# EAGLE design VCO-Simple-Middle (EAGLE 9.1.0)
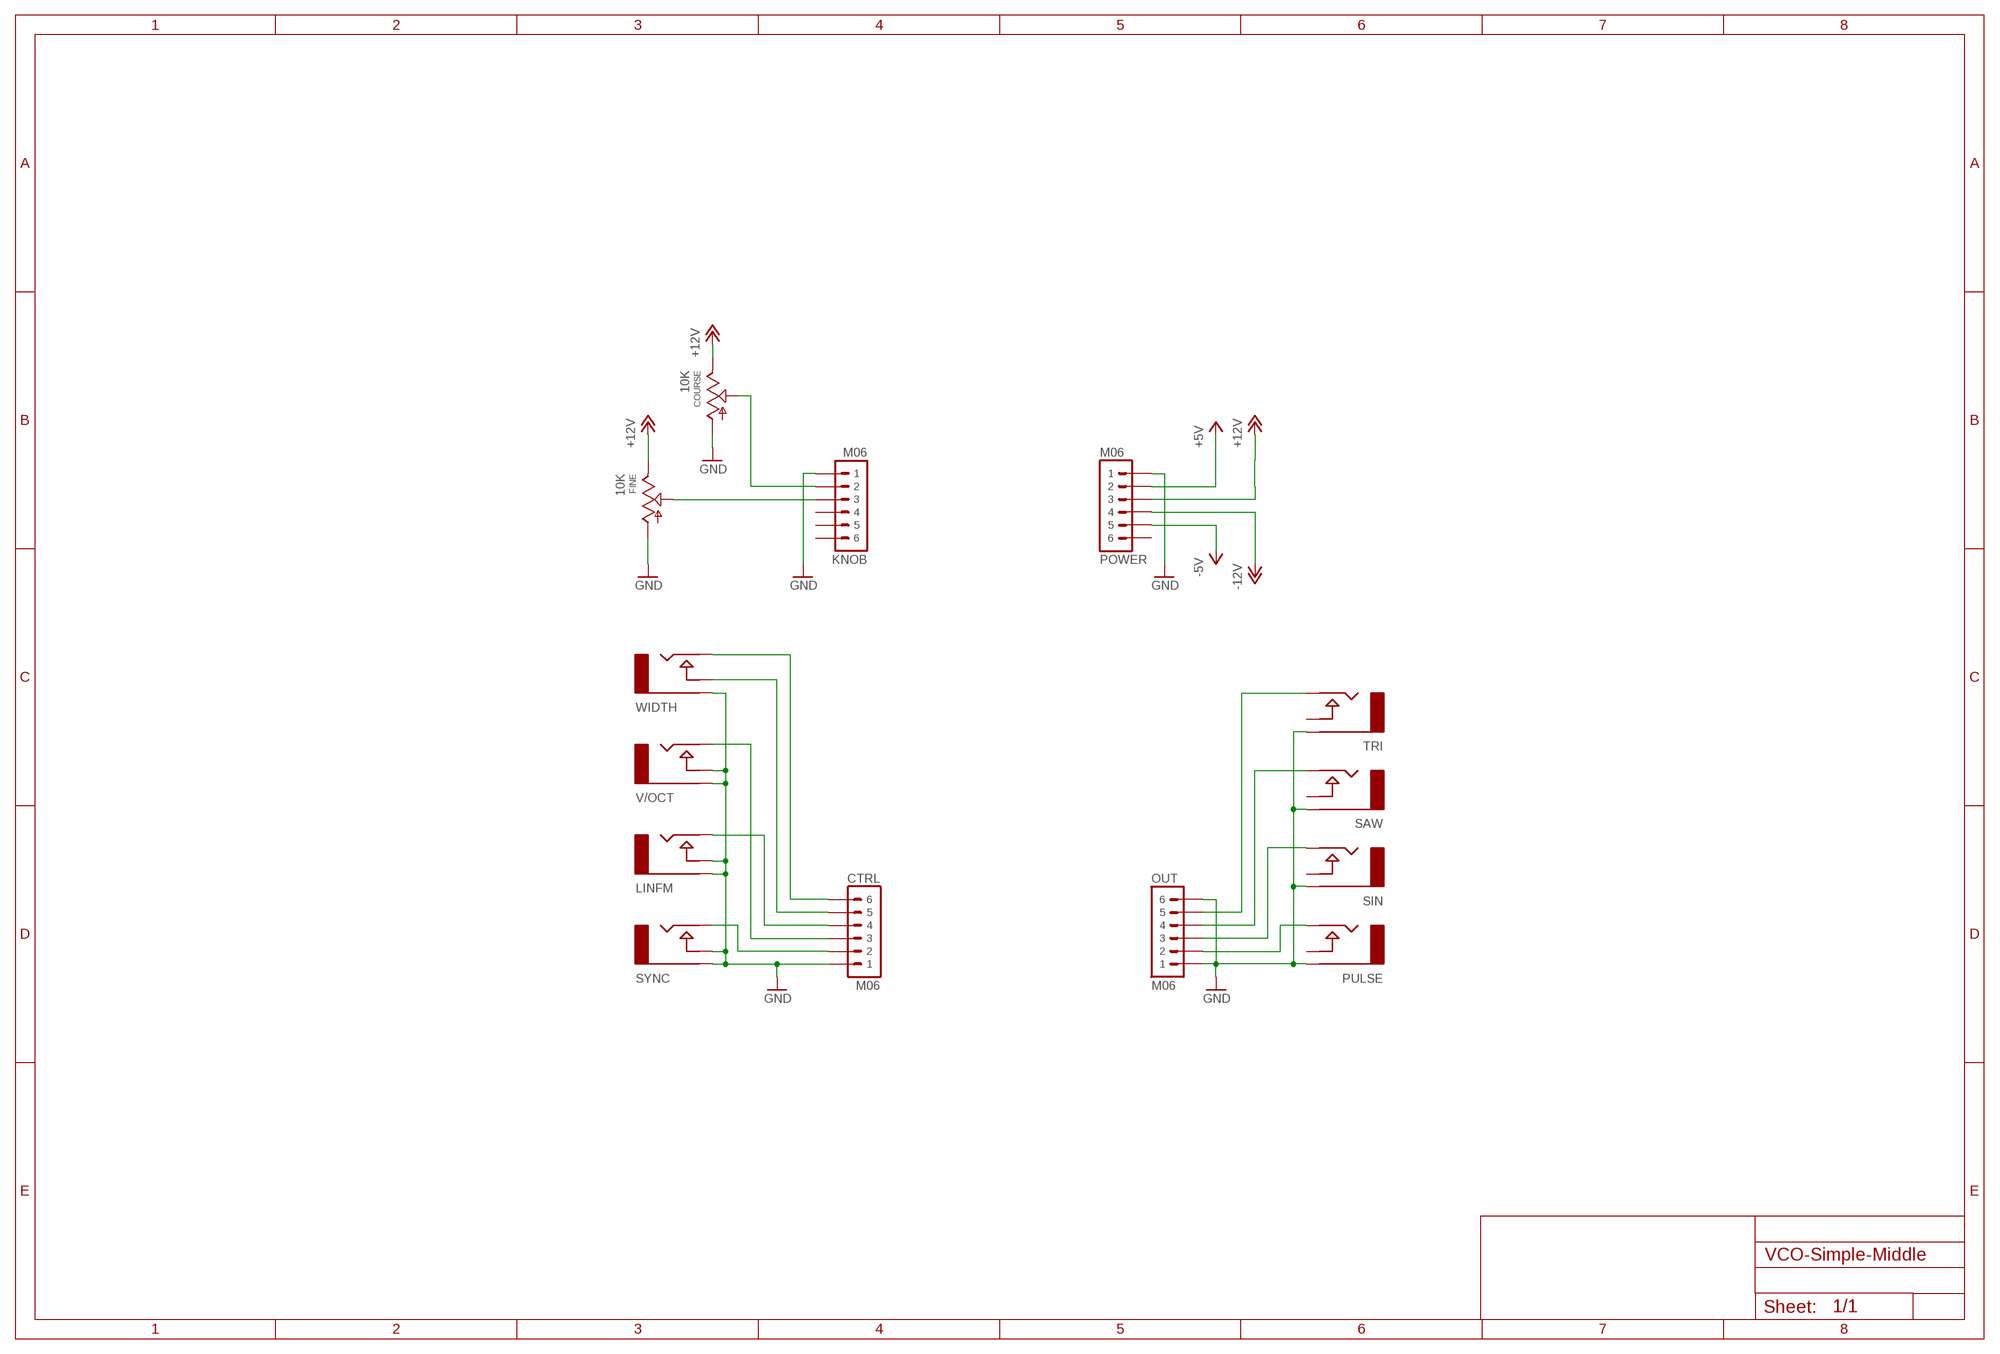
[diagram p0: schematic, sheet 1]

## Parts
COURSE  10K  POTALPHA-9MM  [POT-ALPHA-9MM]
CTRL  M06  [M06]
FINE  10K  POTALPHA-9MM  [POT-ALPHA-9MM]
KNOB  M06  [M06]
LINFM  AUDIO-JACKINLINE  [ERTHENVAR-JACK-INLINE]
OUT  M06  [M06]
POWER  M06  [M06]
PULSE  AUDIO-JACKINLINE  [ERTHENVAR-JACK-INLINE]
SAW  AUDIO-JACKINLINE  [ERTHENVAR-JACK-INLINE]
SIN  AUDIO-JACKINLINE  [ERTHENVAR-JACK-INLINE]
SYNC  AUDIO-JACKINLINE  [ERTHENVAR-JACK-INLINE]
TRI  AUDIO-JACKINLINE  [ERTHENVAR-JACK-INLINE]
V/OCT  AUDIO-JACKINLINE  [ERTHENVAR-JACK-INLINE]
WIDTH  AUDIO-JACKINLINE  [ERTHENVAR-JACK-INLINE]

## Nets
+5V: POWER.2
+12V: COURSE.B(E) FINE.B(E) POWER.3
-5V: POWER.5
-12V: POWER.4
COURSE: COURSE.W(S) KNOB.2
FINE: FINE.W(S) KNOB.3
GND: COURSE.A CTRL.1 FINE.A KNOB.1 LINFM.G(RING) LINFM.N(NORM) OUT.1 OUT.6 POWER.1 PULSE.G(RING) SAW.G(RING) SIN.G(RING) SYNC.G(RING) SYNC.N(NORM) TRI.G(RING) V/OCT.G(RING) V/OCT.N(NORM) WIDTH.G(RING)
LIN: CTRL.4 LINFM.T(TIP)
PULSE: OUT.2 PULSE.T(TIP)
SAW: OUT.4 SAW.T(TIP)
SIN: OUT.3 SIN.T(TIP)
SYNC: CTRL.2 SYNC.T(TIP)
TRI: OUT.5 TRI.T(TIP)
V/OCT: CTRL.3 V/OCT.T(TIP)
WIDTH: CTRL.6 WIDTH.T(TIP)
WIDTH-NORM: CTRL.5 WIDTH.N(NORM)
Unconnected: KNOB.4 KNOB.5 KNOB.6 POWER.6 PULSE.N(NORM) SAW.N(NORM) SIN.N(NORM) TRI.N(NORM)

## Library data of the parts
COURSE FINE = barsstronics:POT
CTRL KNOB OUT POWER = barsstronics:M06
LINFM PULSE SAW SIN SYNC TRI V/OCT WIDTH = erthenvar:AUDIO-JACK: Switching Mono 3.5mm Audio Jack from Erthenvar. Horizontal package.

## Board
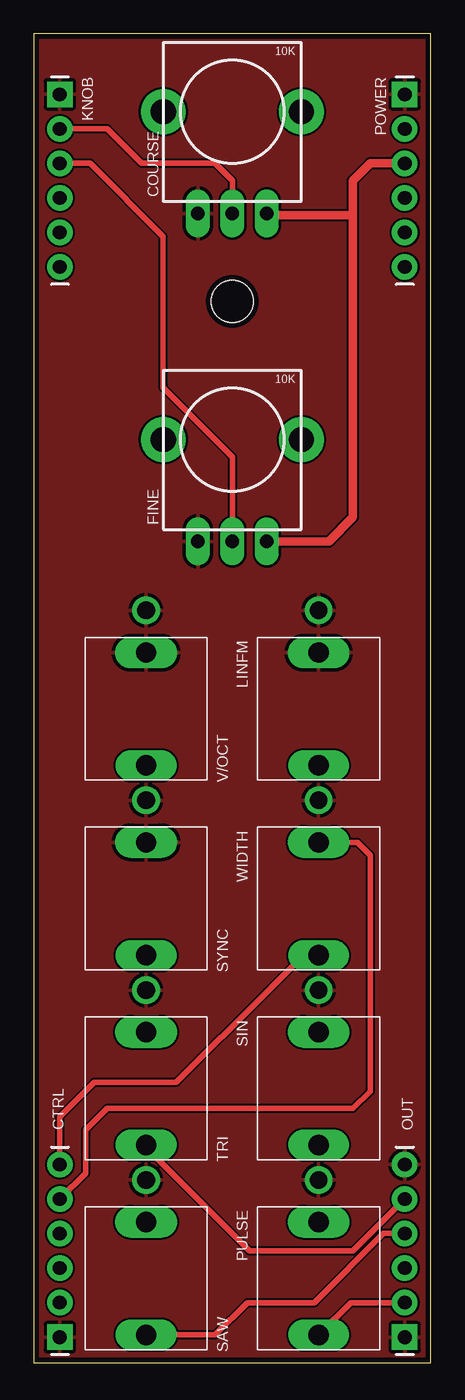
[diagram p1: board, top side]
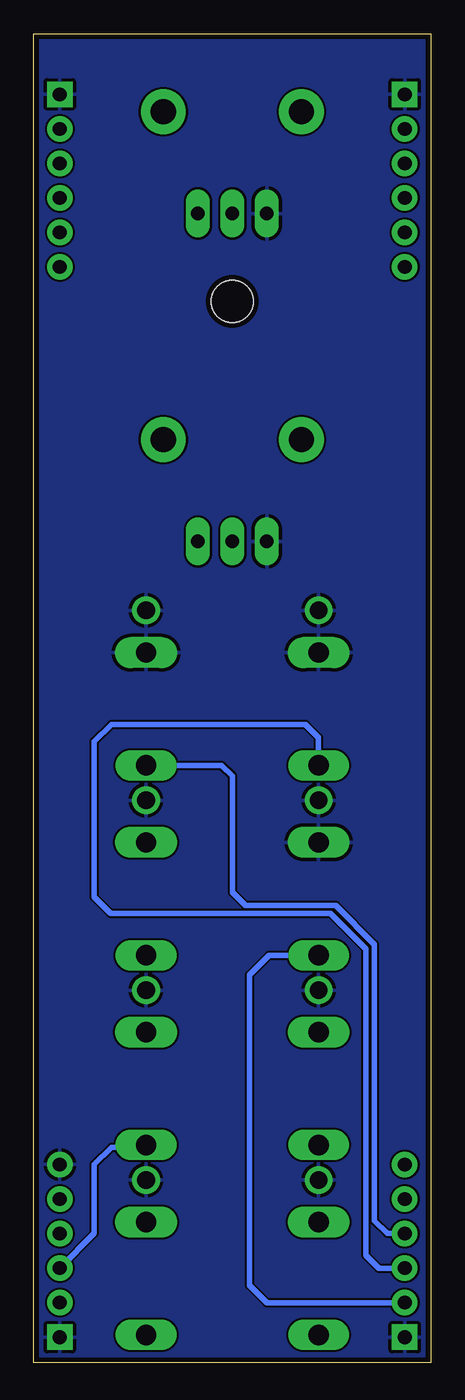
[diagram p2: board, bottom side, seen from below]

Size 29.21 x 97.79 mm. Coordinates in mm from the lower left corner, seen from the top.
Outline: 0,0 29.21,0 29.21,97.79 0,97.79 0,0
Copper layers (1*16): Top 0.035559375mm / dielectric 1.6mm / Bottom 0.035559375mm
Design rules "oshpark-2layer": minimum track width 6mil, minimum drill 10mil, track to track 6mil, track to pad 6mil, pad to pad 6mil, via to via 6mil, smd to smd 6mil, copper to edge 15mil, drill to drill 6mil, minimum pad ring 5mil, minimum via ring 5mil, stop-mask expansion 2.5mil, vias tented up to drill 0mil, thermal gap 10mil
Holes 3.1 mm at 14.61,78.1
tKeepout: area 12.1,75.6 to 17.1,80.6
bKeepout: area 12.1,75.6 to 17.1,80.6

### Footprints (pad centres in the part's own frame; a part is rotated, then mirrored left to right if it is on the bottom)
POT-ALPHA-9MM = drill 1 pad 1.778 long: A -2.54,-7.493; B 2.54,-7.493; W 0,-7.493 | drill 1.85 pad 3.302: MNT1 -5.08,0; MNT2 5.08,0
M06 = drill 1.016 pad 1.88 square: 1 0,0 | drill 1.016 pad 1.88: 2 2.54,0; 3 5.08,0; 4 7.62,0; 5 10.16,0; 6 12.7,0
ERTHENVAR-JACK-INLINE = drill 1.3 pad 2.032: G 0,-6.48 | drill 1.5 pad 2.286 long: N 0,-3.38 | drill 1.5 pad 2.235 long: T 0,4.92

### Placement (x,y rotation side)
COURSE  14.61,92.07 0 top
CTRL  1.91,1.91 90 top
FINE  14.61,67.94 0 top
KNOB  1.91,93.34 270 top
LINFM  20.95,48.9 180 top
OUT  27.3,1.91 90 top
POWER  27.3,93.34 270 top
PULSE  20.95,6.99 180 top
SAW  8.26,6.99 180 top
SIN  20.95,20.95 180 top
SYNC  8.26,34.93 180 top
TRI  8.26,20.95 180 top
V/OCT  8.26,48.9 180 top
WIDTH  20.95,34.93 180 top

### Tracks (layer width: path | path; a pad name or v marks a point on that pad's centre or on a via)
+12V
  Top 0.61: COURSE.B 17.27,84.45 22.22,84.45 23.49,84.45 | 23.49,84.45 23.49,62.23 21.72,60.45 FINE.B | 23.49,84.45 23.49,86.99 24.76,88.27 POWER.3
COURSE
  Top 0.406: COURSE.W 14.61,86.99 13.34,88.27 7.94,88.27 5.4,90.8 KNOB.2
FINE
  Top 0.406: FINE.W 14.61,66.67 9.53,71.75 9.53,82.87 4.13,88.27 KNOB.3
GND
  pour Top: 29.21,97.79 29.21,0 0,0 0,97.79 1.27,97.79
  pour Bottom: 29.21,97.79 29.21,0 0,0 0,97.79
LIN
  Bottom 0.406: CTRL.4 3.17,9.53 4.13,10.48 4.13,30.8 6.99,33.66 13.65,33.66 14.61,34.61 14.61,43.18 15.4,43.98 LINFM.T
PULSE
  Top 0.406: PULSE.T 23.33,4.45 OUT.2
SAW
  Top 0.406: SAW.T 13.34,2.07 15.72,4.45 20.64,4.45 25.72,9.53 OUT.4
SIN
  Bottom 0.406: SIN.T 21.11,15.88 21.03,15.8 21.11,15.88 23.49,15.88 24.76,14.61 24.76,9.53 OUT.3
SYNC
  Bottom 0.406: CTRL.2 12.06,4.45 13.34,5.71 13.34,28.57 11.9,30 SYNC.T
TRI
  Top 0.406: OUT.5 23.49,8.26 15.88,8.26 8.26,15.88 TRI.T
V/OCT
  Bottom 0.406: V/OCT.T 8.26,46.04 9.21,46.99 23.49,46.99 24.76,45.72 24.76,34.29 23.57,33.1 7.38,33.1 4.76,30.48 4.76,7.94 3.81,6.99 CTRL.3
WIDTH
  Top 0.406: CTRL.6 1.91,18.1 4.45,20.64 10.48,20.64 17.14,27.3 19.84,30 WIDTH.T
WIDTH-NORM
  Top 0.406: CTRL.5 3.81,13.97 3.81,17.14 5.4,18.73 23.49,18.73 24.76,20 24.76,37.35 23.81,38.3 WIDTH.N

### Text on the board
tRestrict: VCO3340 / revC
bRestrict: VCO3340 / revC